# Altium schematic sheet 10_Alimentacion_Externa.SchDoc
size A4; SheetNumber: 2; SheetTotal: 11
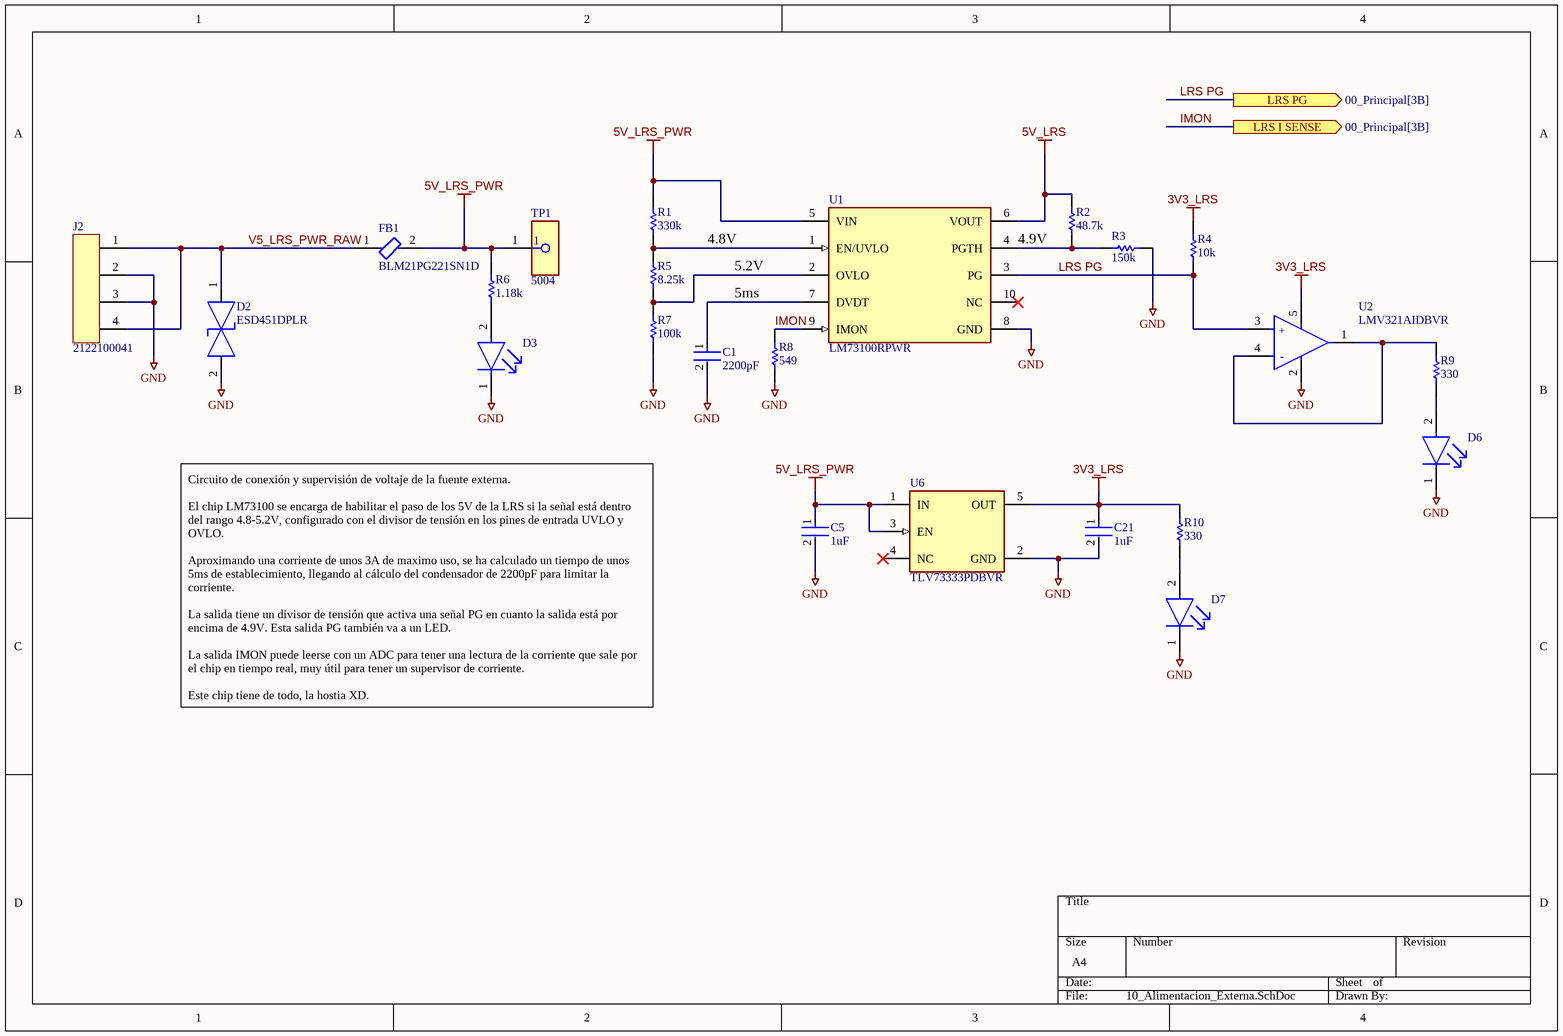
[diagram p0: 10_Alimentacion_Externa.SchDoc]

## Parts
C1  2200pF  [FP-AC0402-0_5-MFG]
C5  1uF  [FP-C0402C-BB-IPC_B]
C21  1uF  [FP-C0402C-BB-IPC_B]
D2  ESD451DPLR  [FP-DPL0002A_MFG]
D3  APHD1608LZGCK  [FP-APHD1608LZGCK-MFG]  (value not drawn)
D6  APHD1608LZGCK  [FP-APHD1608LZGCK-MFG]  (value not drawn)
D7  APHD1608LZGCK  [FP-APHD1608LZGCK-MFG]  (value not drawn)
FB1  BLM21PG221SN1D  [FP-BLM21-0_2-t0_85-e0_5-IPC_B]
J2  2122100041  [2122100041]
R1  330k  [RESC1005X40X25ML05T05]
R2  48.7k  [RESC1005X40X25ML05T05]
R3  150k  [RESC1005X40X25NL05T05]
R4  10k  [RESC1005X40X25ML05T05]
R5  8.25k  [RESC1005X40X25LL05T05]
R6  1.18k  [RESC1005X40X25NL05T05]
R7  100k  [RESC1005X40X25LL05T05]
R8  549  [RESC1005X40X25LL05T05]
R9  330  [RESC1005X40X25NL10T10]
R10  330  [RESC1005X40X25NL10T10]
TP1  5004  [FP-5004-MFG]
U1  LM73100RPWR  [FP-RPW0010A-MFG]
U2  LMV321AIDBVR  [FP-DBV0005A-MFG]
U6  TLV73333PDBVR  [FP-DBV0005A-MFG]

## Ports
LRS I SENSE (out, see 00_Principal[3B]), LRS PG (out, see 00_Principal[3B])

## Nets
3V3_LRS: C21.1 R4.2 R10.2 U2.5(V+) U6.5(OUT)
5V_LRS: R2.2 U1.6(VOUT)
5V_LRS_PWR: C5.1 FB1.2 R1.2 R6.2 TP1.1 U1.5(VIN) U6.1(IN) U6.3(EN)
GND: C1.2 C5.2 C21.2 D2.2(2_IO) D3.1(C) D6.1(C) D7.1(C) J2.2 J2.3 R3.2 R7.2 R8.1 U1.8(GND) U2.2(V-) U6.2(GND)
IMON: R8.2 U1.9(IMON) ; port LRS I SENSE
LRS PG: R4.1 U1.3(PG) U2.3(+IN) ; port LRS PG
V5_LRS_PWR_RAW: D2.1(1_IO) FB1.1 J2.1 J2.4
NetC1_1: C1.1 U1.7(DVDT)
NetD3_2: D3.2(A) R6.1
NetD6_2: D6.2(A) R9.1
NetD7_2: D7.2(A) R10.1
NetR1_1: R1.1 R5.2 U1.1(EN/UVLO)
NetR2_1: R2.1 R3.1 U1.4(PGTH)
NetR5_1: R5.1 R7.1 U1.2(OVLO)
NetR9_2: R9.2 U2.1(OUT) U2.4(-IN)

Not connected (* = marked no-connect by the designer): U1 10(NC)*; U6 4(NC)*

## Notes on the sheet
- 4.8V
- 4.9V
- 5.2V
- 5ms
- Circuito de conexión y supervisión de voltaje de la fuente externa.
  El chip LM73100 se encarga de habilitar el paso de los 5V de la LRS si la señal está dentro del rango 4.8-5.2V, configurado con el divisor de tensión en los pines de entrada UVLO y OVLO.
  Aproximando una corriente de unos 3A de maximo uso, se ha calculado un tiempo de unos 5ms de establecimiento, llegando al cálculo del condensador de 2200pF para limitar la corriente.
  La salida tiene un divisor de tensión que activa una señal PG en cuanto la salida está por encima de 4.9V. Esta salida PG también va a un LED.
  La salida IMON puede leerse con un ADC para tener una lectura de la corriente que sale por el chip en tiempo real, muy útil para tener un supervisor de corriente.
  Este chip tiene de todo, la hostia XD.
- (in symbol CMP-04895-000333-1) +; -

## Library data of the parts
C1 = CMP-03422-000165-1: CAP CER 2200PF 16V X7R 0402; Manufacturer Part Number: AC0402KRX7R7BB222; Manufacturer: Yageo; Capacitance: 2.2 nF; Temperature Coefficient: ±15%; Automotive Grade: Grade 1; Value: 2.2 nF; Material: Ceramic; Tolerance: 0.1; Digikey Description: CAP CER 2200PF 16V X7R 0402; Temperature: -55°C to +125°C; Device Class L1: Passive Components; Device Class L3: Ceramic Capacitors; Temperature Range High: +125°C; Temperature Characteristic: X7R; Lead Free: Yes; Device Class L2: Capacitors; Voltage Rating: 16 V; Package: AC0402-0.5; Temperature Range Low: -55°C; Footprint Url: http://www.yageo.com/exep/pages/download/literatures/UPY-C_GEN_24.pdf; ComponentLink2Description: Datasheet; Automotive: Yes; Mouser Description: Cap Ceramic 0.0022uF 16V X7R 10% SMD 0402 125°C Paper T/R; Octopart: https://octopart.com/ac0402krx7r7bb222-yageo-76900921; Height: 0.55mm; ComponentLink2URL: http://www.yageo.com/documents/recent/UPY-AC_NP0X7R_16V-to-630V_12.pdf; Category: Cap; RoHS: TRUE; Ipc Land Pattern Name: CAPC10050X50
C5 C21 = CMP-03020-034679-1: CAP CER 1UF 16V X5R 0402; Dielectric Material: Ceramic; Tolerance: 10%; RoHS Compliant: Yes; Voltage Rating (DC): 16V; Voltage Rating: 16V; Max Operating Temperature: 85°C; Packaging: Cut Tape; Width: 0.02inch; Dielectric: X5R; Lead Free: Lead Free; Min Operating Temperature: -55°C; Mount: Surface Mount; Case/Package: 0402; Thickness: 0.022inch; REACH SVHC: No SVHC; Length: 0.039inch; Case Code (Metric): 1005; Case Code (Imperial): 0402; Capacitance: 1uF
D2 = CMP-00370-140306676-1: 0.5-pF, 5.5-V, 30-KV bidirectional ESD protection device in 0201 package 2-X2SON -40 to 125; Manufacturer Lifecycle Status: ACTIVE; Thickness: 300µm; ComponentLink3URL: https://www.ti.com/lit/ds/symlink/tpd1e04u04.pdf?ts=1701165483995&ref_url=https%253A%252F%252Fwww.ti.com%252Fproduct%252FTPD1E04U04%252Fpart-details%252FTPD1E04U04DPLR; ComponentLink3Description: Manufacturer's Package Drawing; Lifecycle Status: Production; ComponentLink1URL: http://ti.com; ComponentLink2Description: HelpURL; Width: 300µm; ComponentLink2URL: https://www.ti.com/lit/ds/symlink/esd451.pdf; Height: 320µm; Number of Pins: 2; ComponentLink1Description: Manufacturer's Website; Length: 600µm
D3 D6 D7 = CMP-44529-000045-1: LED GREEN CLEAR 1608 SMD; Test Current: 2mA; Dominant Wavelength: 525nm; Lens Color: Colorless; Luminous Intensity: 180mcd; Viewing Angle: 100°; Forward Voltage: 2.65V; Lens Size: 0.7mm; Lens Style: Round; Mount: Surface Mount; Packaging: Tape and Reel; Lens Transparency: Clear; Height: 0.75mm; Case/Package: 0603; Length: 1.6mm; Case Code (Metric): 1608; Width: 0.8mm; Color: Green; Case Code (Imperial): 0603
FB1 = CMP-0686-00610-3: Chip Ferrite Bead, 0805, 220Ω @ 100MHz, 0.045Ω, 25%, 2A; Number of Circuits: 1; Shielding: Unshielded; DC Resistance (DCR): 45mR; Impedance: 220R; Radiation Hardening: No; Material: Ferrite; Frequency: 100MHz; Width: 1.25mm; DC Current: 2A; Max DC Current: 2A; Number of Lines: 1; Package Quantity: 1; Case Code (Metric): 2012; Current Rating: 2A; Case/Package: 0805; Current: 2A; Military Standard: Not; Core Material: Ferrite; Depth: 1.25mm; Contact Plating: Tin; DC Resistance-Max: 45mR; Max Operating Temperature: 125°C; Length: 2mm; Max Current Rating: 2A; REACH SVHC: No SVHC; Termination: SMD/SMT; Min Operating Temperature: -55°C; Series: BLM21P; Test Frequency: 100MHz; Tolerance: 25%; Number of Pins: 2; RoHS Compliant: Yes; Height: 0.85mm; Packaging: Tape and Reel; Lead Free: Lead Free; Case Code (Imperial): 0805
R1 = CMP-1011-00134-2: Part Number: ERJ-2GEJ334X; Manufacturer: Panasonic
R2 = CMP-2002-00962-1: Part Number: ERJ-2RKF4872X; Manufacturer: Panasonic
R3 = CMP-2002-00459-1: Part Number: ERJ-2GEJ154X; Manufacturer: Panasonic
R4 = CMP-2002-00601-1: Manufacturer: Panasonic; Part Number: ERJ-2RHD1002X
R5 = CMP-2002-01079-1: Part Number: ERJ-2RKF8251X; Manufacturer: Panasonic
R6 = CMP-1011-00517-2: Part Number: ERJ-2RKF1181X; Manufacturer: Panasonic
R7 = CMP-2002-00602-1: Manufacturer: Panasonic; Part Number: ERJ-2RHD1003X
R8 = CMP-2002-00989-1: Manufacturer: Panasonic; Part Number: ERJ-2RKF5490X
R9 R10 = CMP-2002-05883-1: Manufacturer: Panasonic; Part Number: ERA2AEB331X
TP1 = CMP-2000-05575-2: PC TEST POINT MINIATURE YELLOW; Manufacturer: Keystone; Number Of Contacts: 1; Is Female: yes; Device Class L1: Connectors; Manufacturer Part Number: 5004; Digikey Description: PC TEST POINT MINIATURE YELLOW; ComponentLink2URL: https://www.keyelco.com/product-pdf.cfm?p=1313; Lead Free: Yes; ComponentLink2Description: Datasheet; Category: Conn; Height: 4.72mm; Octopart: https://octopart.com/5004-keystone-28591; Mouser Description: TEST POINT PC MINI .040"D YELLOW; Device Class L3: unset; Contact Material: Silver; Package: 5004; Automotive: No; Device Class L2: unset; RoHS: TRUE
U1 = CMP-04910-000122-1: 2.7-V TO 23-V, 5.5-A IDEAL DIODE; RoHS Compliant: Yes
U2 = CMP-04895-000333-1: IC OPAMP GP 1 CIRCUIT SOT23-5; Input Bias Current: 10pA; Output Current per Channel: 40mA; Gain Bandwidth Product: 1MHz; Input Offset Voltage (Vos): 1mV; Number of Channels: 1; Operating Supply Current: 80uA; Slew Rate: 1.7V/µs; Mount: Surface Mount; Min Operating Temperature: -40°C; Packaging: Cut Tape; Case/Package: SOT-23-5; RoHS Compliant: Yes; Max Operating Temperature: 125°C; Number of Circuits: 1
U6 = CMP-04917-000053-1: IC REG LINEAR 3.3V 300MA SOT23-5; Manufacturer: Texas Instruments; Max Junction Temp: +125°C; Accuracy Percentage: 1%; Min Supply Voltage: 1.4V; Number Of Outputs: 1; Dropout Voltage: 125mV; Nominal Supply Current: 34uA; Max Supply Voltage: 5.5V; Output Type: Fixed; Standoff Height: 0mm; Digikey Description: IC REG LINEAR 3.3V 300MA SOT23-5; Manufacturer Part Number: TLV73333PDBVR; Temperature Range High: +125°C; Temperature: -40°C to +125°C; Output Current: 300mA; Mouser Description: LDO Voltage Regulators Capacitr-Free 300-mA 5-SOT-23 -40 to 125; Automotive: No; Height: 1.45mm; Device Class L3: Voltage Regulators - Linear; ComponentLink2Description: Datasheet; Device Class L1: Integrated Circuits (ICs); ComponentLink2URL: http://www.ti.com/lit/ds/symlink/tlv733p.pdf; Octopart: https://octopart.com/tlv73333pdbvr-texas+instruments-51080890; Temperature Range Low: -40°C; RoHS: TRUE; Lead Free: Yes; Output Voltage: 3.3V; Package: DBV0005A; Device Class L2: Power Management ICs; Category: IC